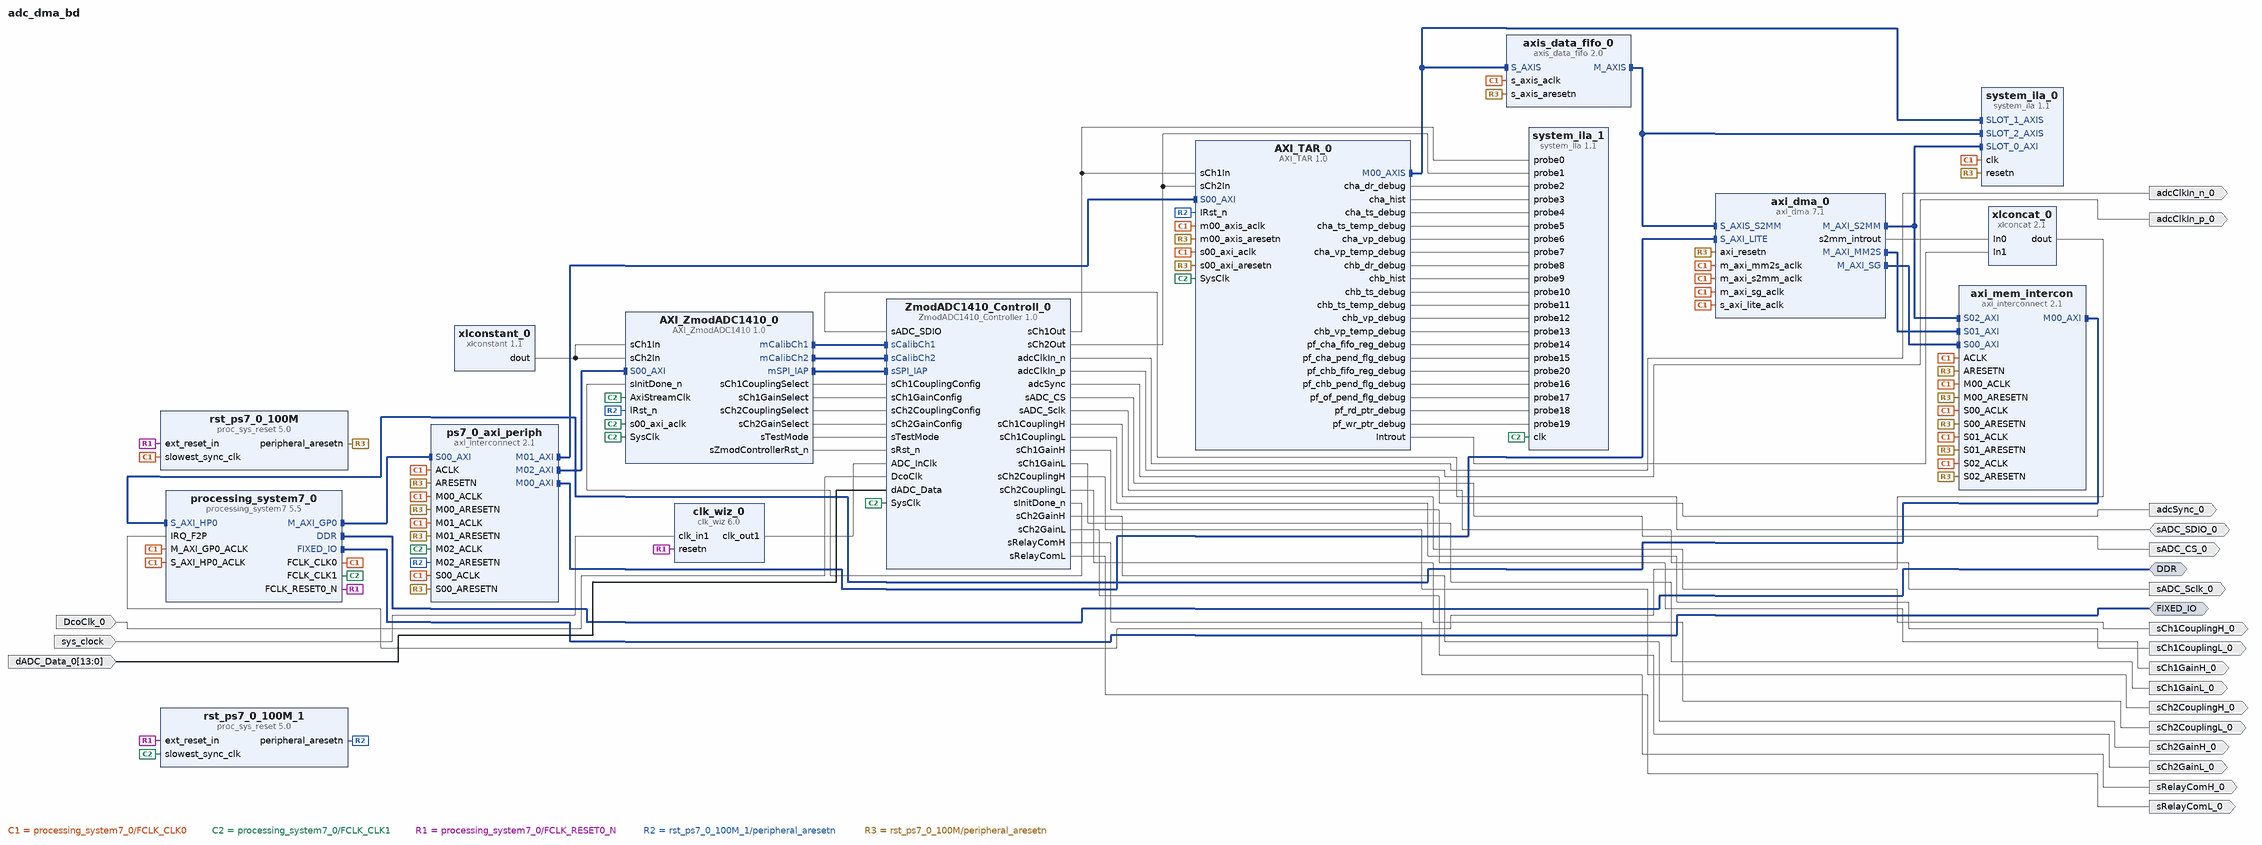
[diagram p0: block diagram of the top level]
# Vivado block design adc_dma_bd, xc7z020clg484-1, Vivado 2023.1
create_bd_design adc_dma_bd

create_bd_intf_port -mode Master -vlnv xilinx.com:interface:ddrx_rtl:1.0 DDR
create_bd_intf_port -mode Master -vlnv xilinx.com:display_processing_system7:fixedio_rtl:1.0 FIXED_IO
create_bd_port -dir I -type clk sys_clock
set_property -dict {CONFIG.FREQ_HZ 125000000 CONFIG.PHASE 0.0} [get_bd_ports sys_clock]
create_bd_port -dir O sCh1GainH_0
create_bd_port -dir O adcClkIn_p_0
create_bd_port -dir O sCh1GainL_0
create_bd_port -dir O sCh2CouplingH_0
create_bd_port -dir O adcClkIn_n_0
create_bd_port -dir O sCh2CouplingL_0
create_bd_port -dir O sRelayComH_0
create_bd_port -dir O sCh2GainH_0
create_bd_port -dir IO sADC_SDIO_0
create_bd_port -dir O adcSync_0
create_bd_port -dir O sCh2GainL_0
create_bd_port -dir O sCh1CouplingH_0
create_bd_port -dir O sCh1CouplingL_0
create_bd_port -dir O sADC_CS_0
create_bd_port -dir O sADC_Sclk_0
create_bd_port -dir O sRelayComL_0
create_bd_port -dir I DcoClk_0
create_bd_port -dir I -from 13 -to 0 dADC_Data_0

create_bd_cell -type ip -vlnv xilinx.com:ip:axi_dma:7.1 axi_dma_0
set_property -dict [list \
  CONFIG.c_include_mm2s 1 \
  CONFIG.c_include_s2mm 1 \
  CONFIG.c_include_s2mm_dre 1 \
  CONFIG.c_s2mm_burst_size 256 \
  CONFIG.c_sg_include_stscntrl_strm 0 \
] [get_bd_cells axi_dma_0]
create_bd_cell -type ip -vlnv xilinx.com:user:ZmodADC1410_Controller:1.0 ZmodADC1410_Controll_0
set_property -dict [list \
  CONFIG.kExtCalibEn true \
  CONFIG.kExtCmdInterfaceEn true \
  CONFIG.kExtRelayConfigEn true \
  CONFIG.kExtSyncEn false \
] [get_bd_cells ZmodADC1410_Controll_0]
create_bd_cell -type ip -vlnv xilinx.com:ip:axi_interconnect:2.1 ps7_0_axi_periph
set_property -dict {CONFIG.NUM_MI 3} [get_bd_cells ps7_0_axi_periph]
create_bd_cell -type ip -vlnv xilinx.com:ip:axi_interconnect:2.1 axi_mem_intercon
set_property -dict {CONFIG.NUM_MI 1 CONFIG.NUM_SI 3} [get_bd_cells axi_mem_intercon]
create_bd_cell -type ip -vlnv xilinx.com:ip:xlconcat:2.1 xlconcat_0
set_property -dict {CONFIG.NUM_PORTS 2} [get_bd_cells xlconcat_0]
create_bd_cell -type ip -vlnv natinst.com:user:AXI_ZmodADC1410:1.0 AXI_ZmodADC1410_0
create_bd_cell -type ip -vlnv xilinx.com:ip:xlconstant:1.1 xlconstant_0
set_property -dict {CONFIG.CONST_VAL 0 CONFIG.CONST_WIDTH 14} [get_bd_cells xlconstant_0]
create_bd_cell -type ip -vlnv xilinx.com:ip:system_ila:1.1 system_ila_0
set_property -dict [list \
  CONFIG.C_DATA_DEPTH 2048 \
  CONFIG.C_MON_TYPE INTERFACE \
  CONFIG.C_NUM_MONITOR_SLOTS 3 \
  CONFIG.C_SLOT 1 \
  CONFIG.C_SLOT_0_APC_EN 1 \
  CONFIG.C_SLOT_0_AXI_AR_SEL_DATA 0 \
  CONFIG.C_SLOT_0_AXI_AR_SEL_TRIG 0 \
  CONFIG.C_SLOT_0_AXI_AW_SEL_DATA 1 \
  CONFIG.C_SLOT_0_AXI_AW_SEL_TRIG 1 \
  CONFIG.C_SLOT_0_AXI_B_SEL_DATA 1 \
  CONFIG.C_SLOT_0_AXI_B_SEL_TRIG 1 \
  CONFIG.C_SLOT_0_AXI_R_SEL_DATA 0 \
  CONFIG.C_SLOT_0_AXI_R_SEL_TRIG 0 \
  CONFIG.C_SLOT_0_AXI_W_SEL_DATA 1 \
  CONFIG.C_SLOT_0_AXI_W_SEL_TRIG 1 \
  CONFIG.C_SLOT_0_INTF_TYPE xilinx.com:interface:aximm_rtl:1.0 \
  CONFIG.C_SLOT_1_APC_EN 0 \
  CONFIG.C_SLOT_1_AXI_DATA_SEL 1 \
  CONFIG.C_SLOT_1_AXI_TRIG_SEL 1 \
  CONFIG.C_SLOT_1_INTF_TYPE xilinx.com:interface:axis_rtl:1.0 \
  CONFIG.C_SLOT_2_APC_EN 0 \
  CONFIG.C_SLOT_2_AXI_DATA_SEL 1 \
  CONFIG.C_SLOT_2_AXI_TRIG_SEL 1 \
  CONFIG.C_SLOT_2_INTF_TYPE xilinx.com:interface:axis_rtl:1.0 \
] [get_bd_cells system_ila_0]
create_bd_cell -type ip -vlnv xilinx.com:ip:system_ila:1.1 system_ila_1
set_property -dict [list \
  CONFIG.C_DATA_DEPTH 2048 \
  CONFIG.C_MON_TYPE NATIVE \
  CONFIG.C_NUM_OF_PROBES 21 \
  CONFIG.C_PROBE0_TYPE 0 \
  CONFIG.C_PROBE10_TYPE 0 \
  CONFIG.C_PROBE11_TYPE 0 \
  CONFIG.C_PROBE12_TYPE 0 \
  CONFIG.C_PROBE13_TYPE 0 \
  CONFIG.C_PROBE14_TYPE 0 \
  CONFIG.C_PROBE15_TYPE 0 \
  CONFIG.C_PROBE16_TYPE 0 \
  CONFIG.C_PROBE17_TYPE 0 \
  CONFIG.C_PROBE18_TYPE 0 \
  CONFIG.C_PROBE19_TYPE 0 \
  CONFIG.C_PROBE1_TYPE 0 \
  CONFIG.C_PROBE20_TYPE 0 \
  CONFIG.C_PROBE21_TYPE 0 \
  CONFIG.C_PROBE2_TYPE 0 \
  CONFIG.C_PROBE3_TYPE 0 \
  CONFIG.C_PROBE4_TYPE 0 \
  CONFIG.C_PROBE5_TYPE 0 \
  CONFIG.C_PROBE6_TYPE 0 \
  CONFIG.C_PROBE7_TYPE 0 \
  CONFIG.C_PROBE8_TYPE 0 \
  CONFIG.C_PROBE9_TYPE 0 \
] [get_bd_cells system_ila_1]
create_bd_cell -type ip -vlnv xilinx.com:ip:axis_data_fifo:2.0 axis_data_fifo_0
set_property -dict {CONFIG.FIFO_DEPTH 512 CONFIG.FIFO_MODE 1} [get_bd_cells axis_data_fifo_0]
create_bd_cell -type ip -vlnv xilinx.com:ip:clk_wiz:6.0 clk_wiz_0
set_property -dict [list \
  CONFIG.CLKIN1_JITTER_PS 80.0 \
  CONFIG.CLKOUT1_JITTER 95.937 \
  CONFIG.CLKOUT1_PHASE_ERROR 96.948 \
  CONFIG.CLKOUT1_REQUESTED_OUT_FREQ 400.000 \
  CONFIG.CLK_IN1_BOARD_INTERFACE sys_clock \
  CONFIG.MMCM_CLKFBOUT_MULT_F 8.000 \
  CONFIG.MMCM_CLKIN1_PERIOD 8.000 \
  CONFIG.MMCM_CLKOUT0_DIVIDE_F 2.500 \
  CONFIG.RESET_PORT resetn \
  CONFIG.RESET_TYPE ACTIVE_LOW \
  CONFIG.USE_BOARD_FLOW true \
  CONFIG.USE_LOCKED false \
] [get_bd_cells clk_wiz_0]
create_bd_cell -type ip -vlnv xilinx.com:ip:processing_system7:5.5 processing_system7_0
set_property -dict [list \
  CONFIG.PCW_APU_PERIPHERAL_FREQMHZ 666.666666 \
  CONFIG.PCW_ENET0_ENET0_IO {MIO 16 .. 27} \
  CONFIG.PCW_ENET0_GRP_MDIO_ENABLE 1 \
  CONFIG.PCW_ENET0_GRP_MDIO_IO {MIO 52 .. 53} \
  CONFIG.PCW_ENET0_PERIPHERAL_ENABLE 1 \
  CONFIG.PCW_ENET0_RESET_ENABLE 1 \
  CONFIG.PCW_ENET0_RESET_IO {MIO 9} \
  CONFIG.PCW_ENET_RESET_ENABLE 1 \
  CONFIG.PCW_ENET_RESET_SELECT {Share reset pin} \
  CONFIG.PCW_EN_CLK1_PORT 1 \
  CONFIG.PCW_FCLK_CLK1_BUF TRUE \
  CONFIG.PCW_FPGA0_PERIPHERAL_FREQMHZ 100 \
  CONFIG.PCW_FPGA1_PERIPHERAL_FREQMHZ 100 \
  CONFIG.PCW_FPGA_FCLK1_ENABLE 1 \
  CONFIG.PCW_GPIO_MIO_GPIO_ENABLE 1 \
  CONFIG.PCW_GPIO_MIO_GPIO_IO MIO \
  CONFIG.PCW_I2C1_I2C1_IO {MIO 12 .. 13} \
  CONFIG.PCW_I2C1_PERIPHERAL_ENABLE 1 \
  CONFIG.PCW_I2C_PERIPHERAL_FREQMHZ 111.111115 \
  CONFIG.PCW_I2C_RESET_ENABLE 1 \
  CONFIG.PCW_I2C_RESET_SELECT {Share reset pin} \
  CONFIG.PCW_IRQ_F2P_INTR 1 \
  CONFIG.PCW_PERIPHERAL_BOARD_PRESET part0 \
  CONFIG.PCW_PRESET_BANK1_VOLTAGE {LVCMOS 1.8V} \
  CONFIG.PCW_QSPI_GRP_FBCLK_ENABLE 1 \
  CONFIG.PCW_QSPI_GRP_FBCLK_IO {MIO 8} \
  CONFIG.PCW_QSPI_GRP_SINGLE_SS_ENABLE 1 \
  CONFIG.PCW_QSPI_GRP_SINGLE_SS_IO {MIO 1 .. 6} \
  CONFIG.PCW_QSPI_PERIPHERAL_ENABLE 1 \
  CONFIG.PCW_QSPI_QSPI_IO {MIO 1 .. 6} \
  CONFIG.PCW_SD0_GRP_CD_ENABLE 1 \
  CONFIG.PCW_SD0_GRP_CD_IO {MIO 47} \
  CONFIG.PCW_SD0_GRP_WP_ENABLE 0 \
  CONFIG.PCW_SD0_PERIPHERAL_ENABLE 1 \
  CONFIG.PCW_SD0_SD0_IO {MIO 40 .. 45} \
  CONFIG.PCW_SDIO_PERIPHERAL_FREQMHZ 50 \
  CONFIG.PCW_SINGLE_QSPI_DATA_MODE x4 \
  CONFIG.PCW_UART0_PERIPHERAL_ENABLE 1 \
  CONFIG.PCW_UART0_UART0_IO {MIO 14 .. 15} \
  CONFIG.PCW_UART1_PERIPHERAL_ENABLE 0 \
  CONFIG.PCW_UART_PERIPHERAL_FREQMHZ 100 \
  CONFIG.PCW_UIPARAM_DDR_FREQ_MHZ 533.333333 \
  CONFIG.PCW_UIPARAM_DDR_MEMORY_TYPE {DDR 3 (Low Voltage)} \
  CONFIG.PCW_UIPARAM_DDR_PARTNO {MT41K256M16 RE-125} \
  CONFIG.PCW_USB0_PERIPHERAL_ENABLE 1 \
  CONFIG.PCW_USB0_RESET_ENABLE 1 \
  CONFIG.PCW_USB0_RESET_IO {MIO 46} \
  CONFIG.PCW_USB0_USB0_IO {MIO 28 .. 39} \
  CONFIG.PCW_USB_RESET_ENABLE 1 \
  CONFIG.PCW_USB_RESET_SELECT {Share reset pin} \
  CONFIG.PCW_USE_FABRIC_INTERRUPT 1 \
  CONFIG.PCW_USE_S_AXI_HP0 1 \
] [get_bd_cells processing_system7_0]
# 514 more settings of processing_system7_0 are not shown: defaults, MIO pin electricals, DDR timing, and values the tool derives
create_bd_cell -type ip -vlnv xilinx.com:ip:proc_sys_reset:5.0 rst_ps7_0_100M
create_bd_cell -type ip -vlnv xilinx.com:ip:proc_sys_reset:5.0 rst_ps7_0_100M_1
create_bd_cell -type ip -vlnv user.org:user:AXI_TAR:1.0 AXI_TAR_0
set_property -dict [list \
  CONFIG.C_M00_AXIS_START_COUNT 32 \
  CONFIG.C_M00_AXIS_TDATA_WIDTH 64 \
  CONFIG.G_MARK_DEBUG true \
] [get_bd_cells AXI_TAR_0]

# ---- connections ----

connect_bd_intf_net -intf_net AXI_TAR_0_M00_AXIS [get_bd_intf_pins axis_data_fifo_0/S_AXIS] [get_bd_intf_pins AXI_TAR_0/M00_AXIS]
connect_bd_intf_net [get_bd_intf_pins axis_data_fifo_0/S_AXIS] [get_bd_intf_pins system_ila_0/SLOT_1_AXIS]
connect_bd_intf_net [get_bd_intf_pins AXI_ZmodADC1410_0/mCalibCh1] [get_bd_intf_pins ZmodADC1410_Controll_0/sCalibCh1]
connect_bd_intf_net [get_bd_intf_pins AXI_ZmodADC1410_0/mCalibCh2] [get_bd_intf_pins ZmodADC1410_Controll_0/sCalibCh2]
connect_bd_intf_net [get_bd_intf_pins AXI_ZmodADC1410_0/mSPI_IAP] [get_bd_intf_pins ZmodADC1410_Controll_0/sSPI_IAP]
connect_bd_intf_net [get_bd_intf_pins axi_dma_0/M_AXI_MM2S] [get_bd_intf_pins axi_mem_intercon/S01_AXI]
connect_bd_intf_net [get_bd_intf_pins axi_dma_0/M_AXI_S2MM] [get_bd_intf_pins axi_mem_intercon/S02_AXI]
connect_bd_intf_net [get_bd_intf_pins axi_dma_0/M_AXI_S2MM] [get_bd_intf_pins system_ila_0/SLOT_0_AXI]
connect_bd_intf_net [get_bd_intf_pins axi_dma_0/M_AXI_SG] [get_bd_intf_pins axi_mem_intercon/S00_AXI]
connect_bd_intf_net [get_bd_intf_pins axi_mem_intercon/M00_AXI] [get_bd_intf_pins processing_system7_0/S_AXI_HP0]
connect_bd_intf_net -intf_net axis_data_fifo_0_M_AXIS [get_bd_intf_pins axis_data_fifo_0/M_AXIS] [get_bd_intf_pins axi_dma_0/S_AXIS_S2MM]
connect_bd_intf_net [get_bd_intf_pins axis_data_fifo_0/M_AXIS] [get_bd_intf_pins system_ila_0/SLOT_2_AXIS]
connect_bd_intf_net [get_bd_intf_ports DDR] [get_bd_intf_pins processing_system7_0/DDR]
connect_bd_intf_net [get_bd_intf_ports FIXED_IO] [get_bd_intf_pins processing_system7_0/FIXED_IO]
connect_bd_intf_net [get_bd_intf_pins processing_system7_0/M_AXI_GP0] [get_bd_intf_pins ps7_0_axi_periph/S00_AXI]
connect_bd_intf_net [get_bd_intf_pins ps7_0_axi_periph/M00_AXI] [get_bd_intf_pins axi_dma_0/S_AXI_LITE]
connect_bd_intf_net [get_bd_intf_pins ps7_0_axi_periph/M01_AXI] [get_bd_intf_pins AXI_TAR_0/S00_AXI]
connect_bd_intf_net [get_bd_intf_pins ps7_0_axi_periph/M02_AXI] [get_bd_intf_pins AXI_ZmodADC1410_0/S00_AXI]
connect_bd_net [get_bd_pins AXI_TAR_0/Introut] [get_bd_pins xlconcat_0/In1]
connect_bd_net [get_bd_pins AXI_ZmodADC1410_0/sCh1CouplingSelect] [get_bd_pins ZmodADC1410_Controll_0/sCh1CouplingConfig]
connect_bd_net [get_bd_pins AXI_ZmodADC1410_0/sCh1GainSelect] [get_bd_pins ZmodADC1410_Controll_0/sCh1GainConfig]
connect_bd_net [get_bd_pins AXI_ZmodADC1410_0/sCh2CouplingSelect] [get_bd_pins ZmodADC1410_Controll_0/sCh2CouplingConfig]
connect_bd_net [get_bd_pins AXI_ZmodADC1410_0/sCh2GainSelect] [get_bd_pins ZmodADC1410_Controll_0/sCh2GainConfig]
connect_bd_net [get_bd_pins AXI_ZmodADC1410_0/sTestMode] [get_bd_pins ZmodADC1410_Controll_0/sTestMode]
connect_bd_net [get_bd_pins AXI_ZmodADC1410_0/sZmodControllerRst_n] [get_bd_pins ZmodADC1410_Controll_0/sRst_n]
connect_bd_net -net DcoClk_0_1 [get_bd_ports DcoClk_0] [get_bd_pins ZmodADC1410_Controll_0/DcoClk]
connect_bd_net [get_bd_ports sADC_SDIO_0] [get_bd_pins ZmodADC1410_Controll_0/sADC_SDIO]
connect_bd_net [get_bd_pins ZmodADC1410_Controll_0/adcClkIn_n] [get_bd_ports adcClkIn_n_0]
connect_bd_net [get_bd_pins ZmodADC1410_Controll_0/adcClkIn_p] [get_bd_ports adcClkIn_p_0]
connect_bd_net [get_bd_pins ZmodADC1410_Controll_0/adcSync] [get_bd_ports adcSync_0]
connect_bd_net [get_bd_pins ZmodADC1410_Controll_0/sADC_CS] [get_bd_ports sADC_CS_0]
connect_bd_net [get_bd_pins ZmodADC1410_Controll_0/sADC_Sclk] [get_bd_ports sADC_Sclk_0]
connect_bd_net [get_bd_pins ZmodADC1410_Controll_0/sCh1CouplingH] [get_bd_ports sCh1CouplingH_0]
connect_bd_net [get_bd_pins ZmodADC1410_Controll_0/sCh1CouplingL] [get_bd_ports sCh1CouplingL_0]
connect_bd_net [get_bd_pins ZmodADC1410_Controll_0/sCh1GainH] [get_bd_ports sCh1GainH_0]
connect_bd_net [get_bd_pins ZmodADC1410_Controll_0/sCh1GainL] [get_bd_ports sCh1GainL_0]
connect_bd_net -net ZmodADC1410_Controll_0_sCh1Out [get_bd_pins ZmodADC1410_Controll_0/sCh1Out] \
  [get_bd_pins system_ila_1/probe0] [get_bd_pins AXI_TAR_0/sCh1In]
connect_bd_net [get_bd_pins ZmodADC1410_Controll_0/sCh2CouplingH] [get_bd_ports sCh2CouplingH_0]
connect_bd_net [get_bd_pins ZmodADC1410_Controll_0/sCh2CouplingL] [get_bd_ports sCh2CouplingL_0]
connect_bd_net [get_bd_pins ZmodADC1410_Controll_0/sCh2GainH] [get_bd_ports sCh2GainH_0]
connect_bd_net [get_bd_pins ZmodADC1410_Controll_0/sCh2GainL] [get_bd_ports sCh2GainL_0]
connect_bd_net -net ZmodADC1410_Controll_0_sCh2Out [get_bd_pins ZmodADC1410_Controll_0/sCh2Out] \
  [get_bd_pins system_ila_1/probe1] [get_bd_pins AXI_TAR_0/sCh2In]
connect_bd_net [get_bd_pins ZmodADC1410_Controll_0/sInitDone_n] [get_bd_pins AXI_ZmodADC1410_0/sInitDone_n]
connect_bd_net [get_bd_pins ZmodADC1410_Controll_0/sRelayComH] [get_bd_ports sRelayComH_0]
connect_bd_net [get_bd_pins ZmodADC1410_Controll_0/sRelayComL] [get_bd_ports sRelayComL_0]
connect_bd_net [get_bd_pins axi_dma_0/s2mm_introut] [get_bd_pins xlconcat_0/In0]
connect_bd_net -net cha_dr_debug [get_bd_pins AXI_TAR_0/cha_dr_debug] [get_bd_pins system_ila_1/probe2]
connect_bd_net -net cha_hist [get_bd_pins AXI_TAR_0/cha_hist] [get_bd_pins system_ila_1/probe3]
connect_bd_net -net cha_ts_debug [get_bd_pins AXI_TAR_0/cha_ts_debug] [get_bd_pins system_ila_1/probe4]
connect_bd_net -net cha_ts_temp_debug [get_bd_pins AXI_TAR_0/cha_ts_temp_debug] [get_bd_pins system_ila_1/probe5]
connect_bd_net -net cha_vp_debug [get_bd_pins AXI_TAR_0/cha_vp_debug] [get_bd_pins system_ila_1/probe6]
connect_bd_net -net cha_vp_temp_debug [get_bd_pins AXI_TAR_0/cha_vp_temp_debug] [get_bd_pins system_ila_1/probe7]
connect_bd_net -net chb_dr_debug [get_bd_pins AXI_TAR_0/chb_dr_debug] [get_bd_pins system_ila_1/probe8]
connect_bd_net -net chb_hist [get_bd_pins AXI_TAR_0/chb_hist] [get_bd_pins system_ila_1/probe9]
connect_bd_net -net chb_ts_debug [get_bd_pins AXI_TAR_0/chb_ts_debug] [get_bd_pins system_ila_1/probe10]
connect_bd_net -net chb_ts_temp_debug [get_bd_pins AXI_TAR_0/chb_ts_temp_debug] [get_bd_pins system_ila_1/probe11]
connect_bd_net -net chb_vp_debug [get_bd_pins AXI_TAR_0/chb_vp_debug] [get_bd_pins system_ila_1/probe12]
connect_bd_net -net chb_vp_temp_debug [get_bd_pins AXI_TAR_0/chb_vp_temp_debug] [get_bd_pins system_ila_1/probe13]
connect_bd_net [get_bd_pins clk_wiz_0/clk_out1] [get_bd_pins ZmodADC1410_Controll_0/ADC_InClk]
connect_bd_net -net dADC_Data_0_1 [get_bd_ports dADC_Data_0] [get_bd_pins ZmodADC1410_Controll_0/dADC_Data]
connect_bd_net -net pf_cha_fifo_reg_debug [get_bd_pins AXI_TAR_0/pf_cha_fifo_reg_debug] [get_bd_pins system_ila_1/probe14]
connect_bd_net -net pf_cha_pend_flg_debug [get_bd_pins AXI_TAR_0/pf_cha_pend_flg_debug] [get_bd_pins system_ila_1/probe15]
connect_bd_net -net pf_chb_fifo_reg_debug [get_bd_pins AXI_TAR_0/pf_chb_fifo_reg_debug] [get_bd_pins system_ila_1/probe20]
connect_bd_net -net pf_chb_pend_flg_debug [get_bd_pins AXI_TAR_0/pf_chb_pend_flg_debug] [get_bd_pins system_ila_1/probe16]
connect_bd_net -net pf_of_pend_flg_debug [get_bd_pins AXI_TAR_0/pf_of_pend_flg_debug] [get_bd_pins system_ila_1/probe17]
connect_bd_net -net pf_rd_ptr_debug [get_bd_pins AXI_TAR_0/pf_rd_ptr_debug] [get_bd_pins system_ila_1/probe18]
connect_bd_net -net pf_wr_ptr_debug [get_bd_pins AXI_TAR_0/pf_wr_ptr_debug] [get_bd_pins system_ila_1/probe19]
connect_bd_net [get_bd_pins processing_system7_0/FCLK_CLK0] \
  [get_bd_pins axi_dma_0/m_axi_sg_aclk] [get_bd_pins axi_mem_intercon/S00_ACLK] [get_bd_pins axi_dma_0/s_axi_lite_aclk] \
  [get_bd_pins ps7_0_axi_periph/M00_ACLK] [get_bd_pins axi_mem_intercon/ACLK] [get_bd_pins axi_mem_intercon/M00_ACLK] \
  [get_bd_pins axi_mem_intercon/S01_ACLK] [get_bd_pins axi_dma_0/m_axi_s2mm_aclk] [get_bd_pins ps7_0_axi_periph/S00_ACLK] \
  [get_bd_pins ps7_0_axi_periph/ACLK] [get_bd_pins ps7_0_axi_periph/M01_ACLK] [get_bd_pins axi_dma_0/m_axi_mm2s_aclk] \
  [get_bd_pins axi_mem_intercon/S02_ACLK] [get_bd_pins system_ila_0/clk] [get_bd_pins axis_data_fifo_0/s_axis_aclk] \
  [get_bd_pins processing_system7_0/M_AXI_GP0_ACLK] [get_bd_pins processing_system7_0/S_AXI_HP0_ACLK] \
  [get_bd_pins rst_ps7_0_100M/slowest_sync_clk] [get_bd_pins AXI_TAR_0/s00_axi_aclk] [get_bd_pins AXI_TAR_0/m00_axis_aclk]
connect_bd_net [get_bd_pins processing_system7_0/FCLK_CLK1] \
  [get_bd_pins AXI_ZmodADC1410_0/SysClk] [get_bd_pins ZmodADC1410_Controll_0/SysClk] [get_bd_pins ps7_0_axi_periph/M02_ACLK] \
  [get_bd_pins AXI_ZmodADC1410_0/s00_axi_aclk] [get_bd_pins AXI_ZmodADC1410_0/AxiStreamClk] [get_bd_pins system_ila_1/clk] \
  [get_bd_pins rst_ps7_0_100M_1/slowest_sync_clk] [get_bd_pins AXI_TAR_0/SysClk]
connect_bd_net [get_bd_pins processing_system7_0/FCLK_RESET0_N] \
  [get_bd_pins clk_wiz_0/resetn] [get_bd_pins rst_ps7_0_100M/ext_reset_in] [get_bd_pins rst_ps7_0_100M_1/ext_reset_in]
connect_bd_net [get_bd_pins rst_ps7_0_100M_1/peripheral_aresetn] \
  [get_bd_pins AXI_ZmodADC1410_0/lRst_n] [get_bd_pins ps7_0_axi_periph/M02_ARESETN] [get_bd_pins AXI_TAR_0/IRst_n]
connect_bd_net [get_bd_pins rst_ps7_0_100M/peripheral_aresetn] \
  [get_bd_pins ps7_0_axi_periph/S00_ARESETN] [get_bd_pins axi_dma_0/axi_resetn] [get_bd_pins ps7_0_axi_periph/M00_ARESETN] \
  [get_bd_pins ps7_0_axi_periph/ARESETN] [get_bd_pins axi_mem_intercon/S00_ARESETN] \
  [get_bd_pins axi_mem_intercon/M00_ARESETN] [get_bd_pins axi_mem_intercon/ARESETN] \
  [get_bd_pins ps7_0_axi_periph/M01_ARESETN] [get_bd_pins axi_mem_intercon/S01_ARESETN] \
  [get_bd_pins axi_mem_intercon/S02_ARESETN] [get_bd_pins system_ila_0/resetn] [get_bd_pins axis_data_fifo_0/s_axis_aresetn] \
  [get_bd_pins AXI_TAR_0/s00_axi_aresetn] [get_bd_pins AXI_TAR_0/m00_axis_aresetn]
connect_bd_net [get_bd_ports sys_clock] [get_bd_pins clk_wiz_0/clk_in1]
connect_bd_net [get_bd_pins xlconcat_0/dout] [get_bd_pins processing_system7_0/IRQ_F2P]
connect_bd_net [get_bd_pins xlconstant_0/dout] [get_bd_pins AXI_ZmodADC1410_0/sCh1In] [get_bd_pins AXI_ZmodADC1410_0/sCh2In]
set_property HDL_ATTRIBUTE.DEBUG true [get_bd_intf_nets AXI_TAR_0_M00_AXIS]
set_property HDL_ATTRIBUTE.MARK_DEBUG true [get_bd_intf_nets AXI_TAR_0_M00_AXIS]
set_property HDL_ATTRIBUTE.DEBUG true [get_bd_intf_nets axis_data_fifo_0_M_AXIS]
set_property HDL_ATTRIBUTE.MARK_DEBUG true [get_bd_intf_nets axis_data_fifo_0_M_AXIS]
set_property HDL_ATTRIBUTE.DEBUG true [get_bd_nets ZmodADC1410_Controll_0_sCh1Out]
set_property HDL_ATTRIBUTE.MARK_DEBUG true [get_bd_nets ZmodADC1410_Controll_0_sCh1Out]
set_property HDL_ATTRIBUTE.DEBUG true [get_bd_nets ZmodADC1410_Controll_0_sCh2Out]
set_property HDL_ATTRIBUTE.MARK_DEBUG true [get_bd_nets ZmodADC1410_Controll_0_sCh2Out]
set_property HDL_ATTRIBUTE.DEBUG true [get_bd_nets cha_dr_debug]
set_property HDL_ATTRIBUTE.MARK_DEBUG true [get_bd_nets cha_dr_debug]
set_property HDL_ATTRIBUTE.DEBUG true [get_bd_nets cha_hist]
set_property HDL_ATTRIBUTE.MARK_DEBUG true [get_bd_nets cha_hist]
set_property HDL_ATTRIBUTE.DEBUG true [get_bd_nets cha_ts_debug]
set_property HDL_ATTRIBUTE.MARK_DEBUG true [get_bd_nets cha_ts_debug]
set_property HDL_ATTRIBUTE.DEBUG true [get_bd_nets cha_ts_temp_debug]
set_property HDL_ATTRIBUTE.MARK_DEBUG true [get_bd_nets cha_ts_temp_debug]
set_property HDL_ATTRIBUTE.DEBUG true [get_bd_nets cha_vp_debug]
set_property HDL_ATTRIBUTE.MARK_DEBUG true [get_bd_nets cha_vp_debug]
set_property HDL_ATTRIBUTE.DEBUG true [get_bd_nets cha_vp_temp_debug]
set_property HDL_ATTRIBUTE.MARK_DEBUG true [get_bd_nets cha_vp_temp_debug]
set_property HDL_ATTRIBUTE.DEBUG true [get_bd_nets chb_dr_debug]
set_property HDL_ATTRIBUTE.MARK_DEBUG true [get_bd_nets chb_dr_debug]
set_property HDL_ATTRIBUTE.DEBUG true [get_bd_nets chb_hist]
set_property HDL_ATTRIBUTE.MARK_DEBUG true [get_bd_nets chb_hist]
set_property HDL_ATTRIBUTE.DEBUG true [get_bd_nets chb_ts_debug]
set_property HDL_ATTRIBUTE.MARK_DEBUG true [get_bd_nets chb_ts_debug]
set_property HDL_ATTRIBUTE.DEBUG true [get_bd_nets chb_ts_temp_debug]
set_property HDL_ATTRIBUTE.MARK_DEBUG true [get_bd_nets chb_ts_temp_debug]
set_property HDL_ATTRIBUTE.DEBUG true [get_bd_nets chb_vp_debug]
set_property HDL_ATTRIBUTE.MARK_DEBUG true [get_bd_nets chb_vp_debug]
set_property HDL_ATTRIBUTE.DEBUG true [get_bd_nets chb_vp_temp_debug]
set_property HDL_ATTRIBUTE.MARK_DEBUG true [get_bd_nets chb_vp_temp_debug]
set_property HDL_ATTRIBUTE.DEBUG true [get_bd_nets pf_cha_fifo_reg_debug]
set_property HDL_ATTRIBUTE.MARK_DEBUG true [get_bd_nets pf_cha_fifo_reg_debug]
set_property HDL_ATTRIBUTE.DEBUG true [get_bd_nets pf_cha_pend_flg_debug]
set_property HDL_ATTRIBUTE.MARK_DEBUG true [get_bd_nets pf_cha_pend_flg_debug]
set_property HDL_ATTRIBUTE.DEBUG true [get_bd_nets pf_chb_fifo_reg_debug]
set_property HDL_ATTRIBUTE.MARK_DEBUG true [get_bd_nets pf_chb_fifo_reg_debug]
set_property HDL_ATTRIBUTE.DEBUG true [get_bd_nets pf_chb_pend_flg_debug]
set_property HDL_ATTRIBUTE.MARK_DEBUG true [get_bd_nets pf_chb_pend_flg_debug]
set_property HDL_ATTRIBUTE.DEBUG true [get_bd_nets pf_of_pend_flg_debug]
set_property HDL_ATTRIBUTE.MARK_DEBUG true [get_bd_nets pf_of_pend_flg_debug]
set_property HDL_ATTRIBUTE.DEBUG true [get_bd_nets pf_rd_ptr_debug]
set_property HDL_ATTRIBUTE.MARK_DEBUG true [get_bd_nets pf_rd_ptr_debug]
set_property HDL_ATTRIBUTE.DEBUG true [get_bd_nets pf_wr_ptr_debug]
set_property HDL_ATTRIBUTE.MARK_DEBUG true [get_bd_nets pf_wr_ptr_debug]

# ---- address map ----
assign_bd_address -offset 0x00000000 -range 1G -target_address_space [get_bd_addr_spaces axi_dma_0/Data_MM2S] [get_bd_addr_segs processing_system7_0/S_AXI_HP0/HP0_DDR_LOWOCM]
assign_bd_address -offset 0x00000000 -range 1G -target_address_space [get_bd_addr_spaces axi_dma_0/Data_S2MM] [get_bd_addr_segs processing_system7_0/S_AXI_HP0/HP0_DDR_LOWOCM]
assign_bd_address -offset 0x00000000 -range 1G -target_address_space [get_bd_addr_spaces axi_dma_0/Data_SG] [get_bd_addr_segs processing_system7_0/S_AXI_HP0/HP0_DDR_LOWOCM]
assign_bd_address -offset 0x40400000 -range 64K -target_address_space [get_bd_addr_spaces processing_system7_0/Data] [get_bd_addr_segs axi_dma_0/S_AXI_LITE/Reg]
assign_bd_address -offset 0x43C00000 -range 64K -target_address_space [get_bd_addr_spaces processing_system7_0/Data] [get_bd_addr_segs AXI_ZmodADC1410_0/S00_AXI/S00_AXI_reg]
assign_bd_address -offset 0x43C10000 -range 64K -target_address_space [get_bd_addr_spaces processing_system7_0/Data] [get_bd_addr_segs AXI_TAR_0/S00_AXI/S00_AXI_reg]

validate_bd_design
save_bd_design
